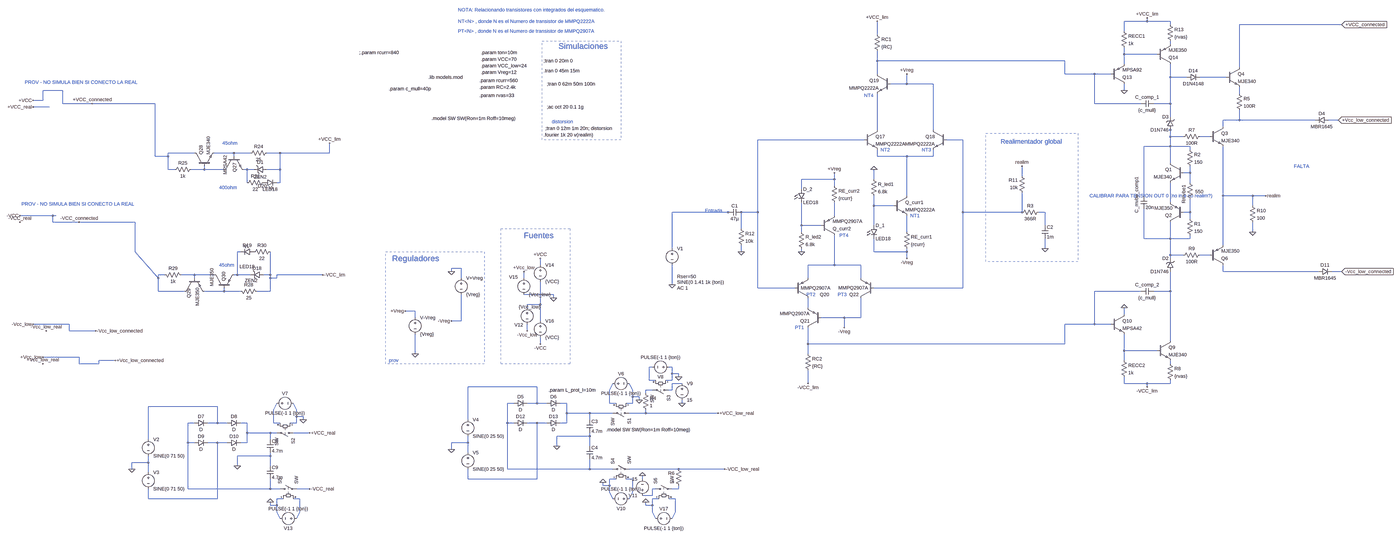
[diagram p0: schematic tercera-etapa-v4.asc, whole sheet]
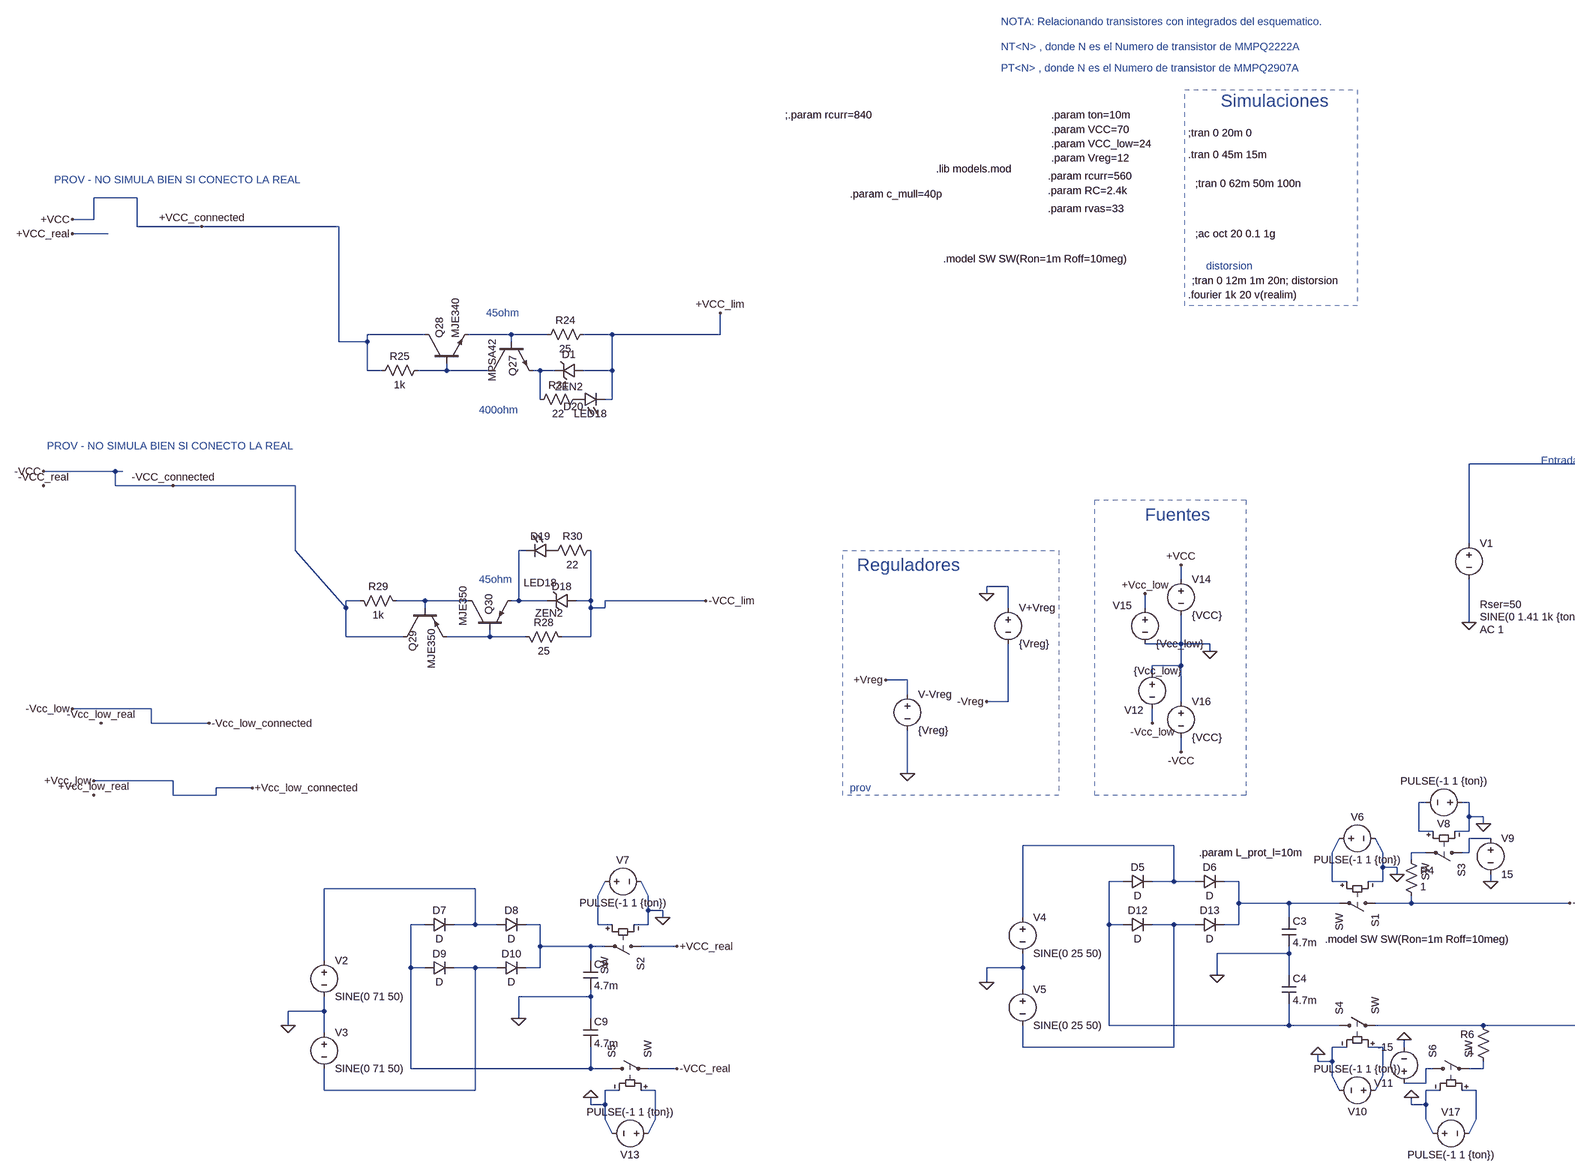
[diagram p1: schematic tercera-etapa-v4.asc, part, row 1 of 1, column 1 of 2]
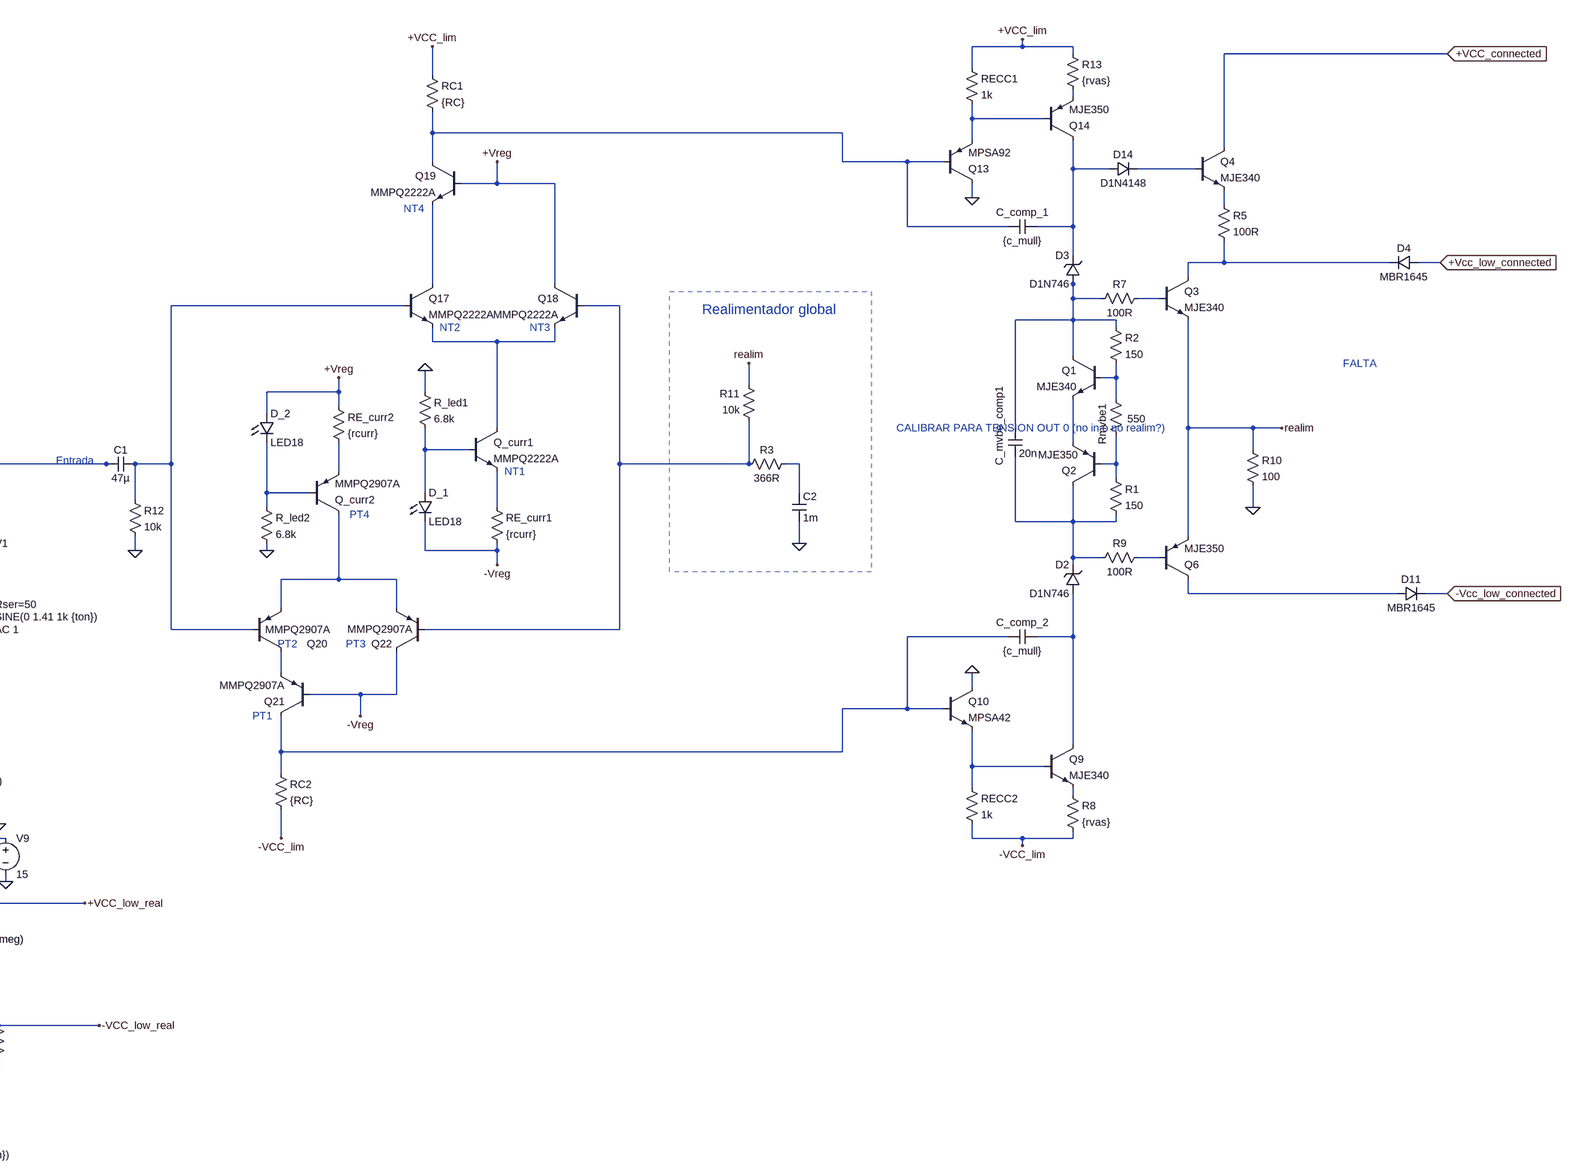
[diagram p2: schematic tercera-etapa-v4.asc, part, row 1 of 1, column 2 of 2]
tercera-etapa-v4.asc, the LTspice schematic file:
Version 4
SHEET 1 6132 2164
WIRE 1792 -752 1792 -768
WIRE 1792 -752 1680 -752
WIRE 1904 -752 1792 -752
WIRE 1904 -736 1904 -752
WIRE 2736 -736 2240 -736
WIRE 1680 -704 1680 -752
WIRE 464 -688 464 -752
WIRE 1904 -640 1904 -656
WIRE 1680 -592 1680 -624
WIRE 1840 -592 1680 -592
WIRE 464 -560 464 -608
WIRE 1392 -560 464 -560
WIRE 1680 -544 1680 -592
WIRE 2240 -528 2240 -736
WIRE 464 -496 464 -560
WIRE 1392 -496 1392 -560
WIRE 1536 -496 1392 -496
WIRE 1616 -496 1536 -496
WIRE 1904 -480 1904 -544
WIRE 1984 -480 1904 -480
WIRE 2176 -480 2048 -480
WIRE 608 -448 608 -496
WIRE 608 -448 528 -448
WIRE 736 -448 608 -448
WIRE -3504 -416 -3600 -416
WIRE 1680 -416 1680 -448
WIRE 2240 -400 2240 -432
WIRE -3600 -368 -3600 -416
WIRE -3600 -368 -3648 -368
WIRE -3504 -352 -3504 -416
WIRE -3360 -352 -3504 -352
WIRE -3056 -352 -3360 -352
WIRE 1536 -352 1536 -496
WIRE 1760 -352 1536 -352
WIRE 1904 -352 1904 -480
WIRE 1904 -352 1824 -352
WIRE -3568 -336 -3648 -336
WIRE 1904 -288 1904 -352
WIRE 2240 -272 2240 -320
WIRE 2240 -272 2160 -272
WIRE 2608 -272 2240 -272
WIRE 2720 -272 2672 -272
WIRE 2160 -240 2160 -272
WIRE 464 -224 464 -400
WIRE 736 -224 736 -448
WIRE 1904 -224 1904 -240
WIRE 1904 -192 1904 -224
WIRE 1968 -192 1904 -192
WIRE 2096 -192 2048 -192
WIRE 400 -176 -128 -176
WIRE 880 -176 800 -176
WIRE 1904 -144 1904 -192
WIRE 1904 -144 1776 -144
WIRE 2000 -144 1904 -144
WIRE 2000 -128 2000 -144
WIRE -2864 -112 -2992 -112
WIRE -2672 -112 -2768 -112
WIRE -2592 -112 -2672 -112
WIRE -2448 -112 -2512 -112
WIRE -2208 -112 -2208 -160
WIRE -2208 -112 -2448 -112
WIRE -3056 -96 -3056 -352
WIRE -2992 -96 -2992 -112
WIRE -2992 -96 -3056 -96
WIRE -2672 -96 -2672 -112
WIRE 464 -96 464 -128
WIRE 608 -96 464 -96
WIRE 736 -96 736 -128
WIRE 736 -96 608 -96
WIRE 1904 -64 1904 -144
WIRE -2992 -32 -2992 -96
WIRE -2960 -32 -2992 -32
WIRE -2816 -32 -2816 -48
WIRE -2816 -32 -2880 -32
WIRE -2720 -32 -2816 -32
WIRE -2608 -32 -2624 -32
WIRE -2576 -32 -2608 -32
WIRE -2448 -32 -2448 -112
WIRE -2448 -32 -2512 -32
WIRE 2000 -16 2000 -48
WIRE 2000 -16 1968 -16
WIRE 1184 0 1184 -48
WIRE 256 16 256 -16
WIRE 256 16 96 16
WIRE 448 16 448 -32
WIRE -2608 32 -2608 -32
WIRE -2448 32 -2448 -32
WIRE -2448 32 -2464 32
WIRE 2000 32 2000 -16
WIRE 256 48 256 16
WIRE 96 64 96 16
WIRE 608 96 608 -96
WIRE 1776 96 1776 -144
WIRE 2160 96 2160 -144
WIRE 2304 96 2160 96
WIRE 2368 96 2304 96
WIRE 1904 128 1904 32
WIRE 448 144 448 96
WIRE 544 144 448 144
WIRE 2304 144 2304 96
WIRE -272 176 -544 176
WIRE -256 176 -272 176
WIRE -128 176 -128 -176
WIRE -128 176 -208 176
WIRE 880 176 880 -176
WIRE 1184 176 1184 80
WIRE 1184 176 880 176
WIRE 1296 176 1264 176
WIRE 2000 176 2000 112
WIRE 2000 176 1968 176
WIRE -3552 192 -3712 192
WIRE -3536 192 -3552 192
WIRE 256 192 256 128
WIRE 2000 208 2000 176
WIRE -3552 224 -3552 192
WIRE -3424 224 -3552 224
WIRE -3152 224 -3424 224
WIRE 96 240 96 128
WIRE 192 240 96 240
WIRE 448 240 448 144
WIRE 1296 240 1296 176
WIRE -208 256 -208 176
WIRE 96 272 96 240
WIRE 608 272 608 192
WIRE 2304 272 2304 224
WIRE 1776 304 1776 160
WIRE 1904 304 1904 224
WIRE 1904 304 1776 304
WIRE 2000 304 2000 288
WIRE 2000 304 1904 304
WIRE 2160 336 2160 96
WIRE -544 352 -544 176
WIRE 1296 352 1296 304
WIRE -3152 368 -3152 224
WIRE -2640 368 -2656 368
WIRE -208 368 -208 336
WIRE 96 368 96 352
WIRE 448 368 448 304
WIRE 608 368 608 352
WIRE 608 368 448 368
WIRE 1904 384 1904 304
WIRE 1968 384 1904 384
WIRE 2096 384 2048 384
WIRE 608 400 608 368
WIRE 1904 400 1904 384
WIRE -1184 432 -1184 400
WIRE 256 432 256 288
WIRE 256 432 128 432
WIRE 384 432 256 432
WIRE -1568 448 -1616 448
WIRE -1616 464 -1616 448
WIRE 2160 464 2160 432
WIRE 2304 464 2160 464
WIRE 2624 464 2304 464
WIRE 2736 464 2688 464
WIRE -3008 480 -3040 480
WIRE -2864 480 -2928 480
WIRE -2768 480 -2864 480
WIRE -2656 480 -2656 368
WIRE -2656 480 -2672 480
WIRE -2592 480 -2656 480
WIRE -2496 480 -2496 368
WIRE -2496 480 -2528 480
WIRE -2240 480 -2464 480
WIRE -3040 496 -3152 368
WIRE -3040 496 -3040 480
WIRE -2864 496 -2864 480
WIRE -2496 496 -2496 480
WIRE -2464 496 -2464 480
WIRE -2464 496 -2496 496
WIRE -1568 496 -1568 448
WIRE -1264 496 -1264 464
WIRE 128 496 128 432
WIRE 384 496 384 432
WIRE -544 528 -544 432
WIRE -128 544 -128 176
WIRE 64 544 -128 544
WIRE 880 544 880 176
WIRE 880 544 448 544
WIRE -3040 560 -3040 496
WIRE -2912 560 -3040 560
WIRE -2720 560 -2720 544
WIRE -2720 560 -2816 560
WIRE -2640 560 -2720 560
WIRE -2496 560 -2496 496
WIRE -2496 560 -2560 560
WIRE 1760 560 1536 560
WIRE 1904 560 1904 464
WIRE 1904 560 1824 560
WIRE -1184 576 -1184 512
WIRE -1184 576 -1264 576
WIRE -1120 576 -1184 576
WIRE -1120 592 -1120 576
WIRE -1184 624 -1184 576
WIRE -1184 624 -1248 624
WIRE -1248 640 -1248 624
WIRE 128 640 128 592
WIRE -1792 656 -1840 656
WIRE 1680 672 1680 640
WIRE -1792 688 -1792 656
WIRE 304 688 192 688
WIRE 384 688 384 592
WIRE 384 688 304 688
WIRE -1568 704 -1568 576
WIRE -1568 704 -1616 704
WIRE -1184 704 -1184 624
WIRE -3472 720 -3648 720
WIRE 1536 720 1536 560
WIRE 1536 720 1392 720
WIRE 1616 720 1536 720
WIRE 304 736 304 688
WIRE -3472 752 -3472 720
WIRE -3344 752 -3472 752
WIRE -1248 752 -1248 720
WIRE 1904 800 1904 560
WIRE -1184 816 -1184 784
WIRE 128 816 128 736
WIRE 1392 816 1392 720
WIRE 1392 816 128 816
WIRE 1680 848 1680 768
WIRE 1840 848 1680 848
WIRE -1792 864 -1792 768
WIRE 128 864 128 816
WIRE -3424 880 -3600 880
WIRE -3248 896 -3328 896
WIRE 1680 896 1680 848
WIRE -3424 912 -3424 880
WIRE -3328 912 -3328 896
WIRE -3328 912 -3424 912
WIRE 1904 912 1904 896
WIRE -640 928 -656 928
WIRE -544 928 -560 928
WIRE -544 960 -544 928
WIRE -512 960 -544 960
WIRE -512 976 -512 960
WIRE -656 992 -656 928
WIRE -624 992 -656 992
WIRE -544 992 -544 960
WIRE -544 992 -576 992
WIRE -496 1008 -544 1008
WIRE 128 1008 128 944
WIRE 1680 1008 1680 976
WIRE 1792 1008 1680 1008
WIRE 1904 1008 1904 992
WIRE 1904 1008 1792 1008
WIRE -1200 1024 -1536 1024
WIRE 1792 1024 1792 1008
WIRE -848 1040 -832 1008
WIRE -736 1040 -752 1008
WIRE -640 1040 -672 1040
WIRE -544 1040 -544 1008
WIRE -544 1040 -560 1040
WIRE -672 1056 -672 1040
WIRE -736 1072 -736 1040
WIRE -704 1072 -736 1072
WIRE -704 1088 -704 1072
WIRE -1312 1104 -1344 1104
WIRE -1200 1104 -1200 1024
WIRE -1200 1104 -1248 1104
WIRE -1152 1104 -1200 1104
WIRE -1056 1104 -1088 1104
WIRE -848 1104 -848 1040
WIRE -816 1104 -848 1104
WIRE -736 1104 -736 1072
WIRE -736 1104 -768 1104
WIRE -496 1104 -496 1088
WIRE -2752 1120 -3088 1120
WIRE -2480 1136 -2464 1104
WIRE -2368 1136 -2384 1104
WIRE -1056 1152 -1056 1104
WIRE -944 1152 -1056 1152
WIRE -832 1152 -944 1152
WIRE -672 1152 -672 1136
WIRE -672 1152 -752 1152
WIRE -320 1152 -672 1152
WIRE -2368 1168 -2368 1136
WIRE -2336 1168 -2368 1168
WIRE -2336 1184 -2336 1168
WIRE -1536 1184 -1536 1024
WIRE -944 1184 -944 1152
WIRE -2864 1200 -2896 1200
WIRE -2752 1200 -2752 1120
WIRE -2752 1200 -2800 1200
WIRE -2704 1200 -2752 1200
WIRE -2608 1200 -2640 1200
WIRE -2480 1200 -2480 1136
WIRE -2448 1200 -2480 1200
WIRE -2368 1200 -2368 1168
WIRE -2368 1200 -2400 1200
WIRE -1344 1200 -1344 1104
WIRE -1312 1200 -1344 1200
WIRE -1200 1200 -1248 1200
WIRE -1152 1200 -1200 1200
WIRE -1056 1200 -1056 1152
WIRE -1056 1200 -1088 1200
WIRE -2608 1248 -2608 1200
WIRE -2496 1248 -2608 1248
WIRE -2464 1248 -2496 1248
WIRE -2304 1248 -2384 1248
WIRE -944 1264 -944 1248
WIRE -944 1264 -1104 1264
WIRE -3088 1280 -3088 1120
WIRE -2496 1280 -2496 1248
WIRE -2896 1296 -2896 1200
WIRE -2864 1296 -2896 1296
WIRE -2752 1296 -2800 1296
WIRE -2704 1296 -2752 1296
WIRE -2608 1296 -2608 1248
WIRE -2608 1296 -2640 1296
WIRE -1536 1296 -1536 1264
WIRE -1536 1296 -1616 1296
WIRE -1104 1312 -1104 1264
WIRE -944 1312 -944 1264
WIRE -1616 1328 -1616 1296
WIRE -1536 1344 -1536 1296
WIRE -2496 1360 -2496 1344
WIRE -2496 1360 -2656 1360
WIRE -3088 1392 -3088 1360
WIRE -3088 1392 -3168 1392
WIRE -2656 1408 -2656 1360
WIRE -2496 1408 -2496 1360
WIRE -3168 1424 -3168 1392
WIRE -1344 1424 -1344 1200
WIRE -944 1424 -944 1376
WIRE -944 1424 -1344 1424
WIRE -832 1424 -944 1424
WIRE -512 1424 -752 1424
WIRE -288 1424 -512 1424
WIRE -3088 1440 -3088 1392
WIRE -1536 1472 -1536 1424
WIRE -1200 1472 -1200 1200
WIRE -1200 1472 -1536 1472
WIRE -816 1472 -848 1472
WIRE -736 1472 -768 1472
WIRE -688 1472 -688 1456
WIRE -880 1504 -880 1488
WIRE -848 1504 -848 1472
WIRE -848 1504 -880 1504
WIRE -2896 1520 -2896 1296
WIRE -2496 1520 -2496 1472
WIRE -2496 1520 -2896 1520
WIRE -2448 1520 -2496 1520
WIRE -2304 1520 -2368 1520
WIRE -624 1520 -640 1520
WIRE -512 1520 -512 1504
WIRE -512 1520 -544 1520
WIRE -848 1536 -848 1504
WIRE -736 1536 -736 1472
WIRE -640 1552 -640 1520
WIRE -640 1552 -688 1552
WIRE -3088 1568 -3088 1520
WIRE -2752 1568 -2752 1296
WIRE -2752 1568 -3088 1568
WIRE -2432 1568 -2464 1568
WIRE -2352 1568 -2384 1568
WIRE -832 1568 -848 1536
WIRE -752 1568 -736 1536
WIRE -608 1568 -640 1568
WIRE -528 1568 -560 1568
WIRE -2496 1600 -2496 1584
WIRE -2464 1600 -2464 1568
WIRE -2464 1600 -2496 1600
WIRE -672 1600 -672 1584
WIRE -640 1600 -640 1568
WIRE -640 1600 -672 1600
WIRE -2464 1632 -2464 1600
WIRE -2352 1632 -2352 1568
WIRE -640 1632 -640 1600
WIRE -528 1632 -528 1568
WIRE -2448 1664 -2464 1632
WIRE -2368 1664 -2352 1632
WIRE -624 1664 -640 1632
WIRE -544 1664 -528 1632
FLAG -208 368 0
FLAG 1680 -416 0
FLAG 1680 640 0
FLAG -1840 656 +Vreg
FLAG -1616 704 -Vreg
FLAG 608 -496 +Vreg
FLAG 608 400 -Vreg
FLAG 256 -16 +Vreg
FLAG 304 736 -Vreg
FLAG 96 368 0
FLAG 448 -32 0
FLAG -1792 864 0
FLAG -1616 464 0
FLAG -3168 1424 0
FLAG -2656 1408 0
FLAG -2304 1248 +VCC_real
FLAG -2304 1520 -VCC_real
FLAG -2336 1184 0
FLAG -3360 -352 +VCC_connected
FLAG -3424 224 -VCC_connected
FLAG -3648 -368 +VCC
FLAG -3648 -336 +VCC_real
FLAG -3712 192 -VCC
FLAG -3712 224 -VCC_real
FLAG -2496 1584 0
FLAG 464 -752 +VCC_lim
FLAG 128 1008 -VCC_lim
FLAG 1792 -768 +VCC_lim
FLAG 1792 1024 -VCC_lim
FLAG -2208 -160 +VCC_lim
FLAG -2240 480 -VCC_lim
FLAG -544 528 0
FLAG 1296 352 0
FLAG 2736 464 -Vcc_low_connected
IOPIN 2736 464 In
FLAG 2720 -272 +Vcc_low_connected
IOPIN 2720 -272 In
FLAG -1616 1328 0
FLAG -1104 1312 0
FLAG -320 1152 +VCC_low_real
FLAG -704 1088 0
FLAG -512 976 0
FLAG -496 1104 0
FLAG -880 1488 0
FLAG -672 1584 0
FLAG -688 1456 0
FLAG -288 1424 -VCC_low_real
FLAG -3344 752 -Vcc_low_connected
FLAG -3648 720 -Vcc_low
FLAG -3584 752 -Vcc_low_real
FLAG -3600 880 +Vcc_low
FLAG -3600 912 +Vcc_low_real
FLAG -3248 896 +Vcc_low_connected
FLAG -1120 592 0
FLAG -1184 400 +VCC
FLAG -1264 464 +Vcc_low
FLAG -1248 752 -Vcc_low
FLAG -1184 816 -VCC
FLAG 2368 96 realim
FLAG 1184 -48 realim
FLAG 2736 -736 +VCC_connected
IOPIN 2736 -736 In
FLAG 2304 272 0
DATAFLAG 2304 464 "round($*100)/100"
SYMBOL npn 1840 800 R0
SYMATTR InstName Q9
SYMATTR Value MJE340
SYMBOL res 1888 896 R0
SYMATTR InstName R8
SYMATTR Value {rvas}
SYMBOL npn 1616 672 R0
SYMATTR InstName Q10
SYMATTR Value MPSA42
SYMBOL res 1200 96 R180
WINDOW 0 36 76 Left 2
WINDOW 3 36 40 Left 2
SYMATTR InstName R11
SYMATTR Value 10k
SYMBOL res -224 240 R0
SYMATTR InstName R12
SYMATTR Value 10k
SYMBOL pnp 1616 -448 M180
SYMATTR InstName Q13
SYMATTR Value MPSA92
SYMBOL pnp 1840 -544 M180
SYMATTR InstName Q14
SYMATTR Value MJE350
SYMBOL res 1888 -752 R0
SYMATTR InstName R13
SYMATTR Value {rvas}
SYMBOL voltage -1568 480 R0
WINDOW 123 0 0 Left 2
WINDOW 39 0 0 Left 2
SYMATTR InstName V+Vreg
SYMATTR Value {Vreg}
SYMBOL npn 544 96 R0
SYMATTR InstName Q_curr1
SYMATTR Value MMPQ2222A
SYMBOL npn 400 -224 R0
SYMATTR InstName Q17
SYMATTR Value MMPQ2222A
SYMBOL npn 800 -224 M0
SYMATTR InstName Q18
SYMATTR Value MMPQ2222A
SYMBOL res 432 0 R0
SYMATTR InstName R_led1
SYMATTR Value 6.8k
SYMBOL res 592 256 R0
SYMATTR InstName RE_curr1
SYMATTR Value {rcurr}
SYMBOL LED 432 240 R0
SYMATTR InstName D_1
SYMATTR Value LED18
SYMBOL res 448 -704 R0
SYMATTR InstName RC1
SYMATTR Value {RC}
SYMBOL npn 528 -496 M0
SYMATTR InstName Q19
SYMATTR Value MMPQ2222A
SYMBOL res 240 32 R0
SYMATTR InstName RE_curr2
SYMATTR Value {rcurr}
SYMBOL pnp 192 288 M180
SYMATTR InstName Q_curr2
SYMATTR Value MMPQ2907A
SYMBOL pnp 64 592 M180
WINDOW 0 121 16 Left 2
WINDOW 3 29 48 Left 2
SYMATTR InstName Q20
SYMATTR Value MMPQ2907A
SYMBOL pnp 192 736 R180
SYMATTR InstName Q21
SYMATTR Value MMPQ2907A
SYMBOL res 112 848 R0
SYMATTR InstName RC2
SYMATTR Value {RC}
SYMBOL pnp 448 592 R180
WINDOW 0 74 16 Left 2
WINDOW 3 28 49 Left 2
SYMATTR InstName Q22
SYMATTR Value MMPQ2907A
SYMBOL LED 80 64 R0
SYMATTR InstName D_2
SYMATTR Value LED18
SYMBOL res 80 256 R0
SYMATTR InstName R_led2
SYMATTR Value 6.8k
SYMBOL res 1664 880 R0
SYMATTR InstName RECC2
SYMATTR Value 1k
SYMBOL res 1664 -720 R0
SYMATTR InstName RECC1
SYMATTR Value 1k
SYMBOL voltage -1792 672 R0
WINDOW 123 0 0 Left 2
WINDOW 39 0 0 Left 2
SYMATTR InstName V-Vreg
SYMATTR Value {Vreg}
SYMBOL voltage -3088 1264 R0
WINDOW 123 0 0 Left 2
WINDOW 39 0 0 Left 2
SYMATTR InstName V2
SYMATTR Value SINE(0 71 50)
SYMBOL diode -2864 1216 R270
WINDOW 0 32 32 VTop 2
WINDOW 3 0 32 VBottom 2
SYMATTR InstName D7
SYMBOL diode -2704 1216 R270
WINDOW 0 32 32 VTop 2
WINDOW 3 0 32 VBottom 2
SYMATTR InstName D8
SYMBOL diode -2864 1312 R270
WINDOW 0 32 32 VTop 2
WINDOW 3 0 32 VBottom 2
SYMATTR InstName D9
SYMBOL diode -2704 1312 R270
WINDOW 0 32 32 VTop 2
WINDOW 3 0 32 VBottom 2
SYMATTR InstName D10
SYMBOL cap -2512 1280 R0
SYMATTR InstName C8
SYMATTR Value 4.7m
SYMBOL voltage -3088 1424 R0
WINDOW 123 0 0 Left 2
WINDOW 39 0 0 Left 2
SYMATTR InstName V3
SYMATTR Value SINE(0 71 50)
SYMBOL cap -2512 1408 R0
SYMATTR InstName C9
SYMATTR Value 4.7m
SYMBOL sw -2368 1248 R90
SYMATTR InstName S2
SYMBOL voltage -2480 1104 R270
WINDOW 0 32 56 VTop 2
WINDOW 3 -32 56 VBottom 2
WINDOW 123 0 0 Left 2
WINDOW 39 0 0 Left 2
SYMATTR InstName V7
SYMATTR Value PULSE(-1 1 {ton})
SYMBOL sw -2464 1520 R270
SYMATTR InstName S5
SYMBOL voltage -2352 1664 R90
WINDOW 0 32 56 VTop 2
WINDOW 3 -32 56 VBottom 2
WINDOW 123 0 0 Left 2
WINDOW 39 0 0 Left 2
SYMATTR InstName V13
SYMATTR Value PULSE(-1 1 {ton})
SYMBOL res -2496 -128 R90
WINDOW 0 0 56 VBottom 2
WINDOW 3 32 56 VTop 2
SYMATTR InstName R24
SYMATTR Value 25
SYMBOL res -2864 -48 R90
WINDOW 0 0 56 VBottom 2
WINDOW 3 32 56 VTop 2
SYMATTR InstName R25
SYMATTR Value 1k
SYMBOL npn -2720 -96 M90
WINDOW 0 32 52 Left 2
WINDOW 3 -6 6 Left 2
SYMATTR InstName Q27
SYMATTR Value MPSA42
SYMBOL npn -2864 -48 R270
SYMATTR InstName Q28
SYMATTR Value MJE340
SYMBOL res -2544 576 M270
WINDOW 0 32 56 VTop 2
WINDOW 3 0 56 VBottom 2
SYMATTR InstName R28
SYMATTR Value 25
SYMBOL res -2912 496 M270
WINDOW 0 32 56 VTop 2
WINDOW 3 0 56 VBottom 2
SYMATTR InstName R29
SYMATTR Value 1k
SYMBOL pnp -2912 496 M90
WINDOW 0 51 21 Left 2
WINDOW 3 46 63 Left 2
SYMATTR InstName Q29
SYMATTR Value MJE350
SYMBOL pnp -2768 544 R270
WINDOW 0 33 46 Left 2
WINDOW 3 8 -11 Left 2
SYMATTR InstName Q30
SYMATTR Value MJE350
SYMBOL zener -2528 464 R90
WINDOW 0 0 32 VBottom 2
WINDOW 3 28 60 VTop 2
SYMATTR InstName D18
SYMATTR Value ZEN2
SYMATTR Description Light Emitting Diode
SYMATTR Type led
SYMBOL LED -2576 352 R90
WINDOW 0 0 32 VBottom 2
WINDOW 3 72 32 VTop 2
SYMATTR InstName D19
SYMATTR Value LED18
SYMBOL res -2480 352 R90
WINDOW 0 0 56 VBottom 2
WINDOW 3 32 56 VTop 2
SYMATTR InstName R30
SYMATTR Value 22
SYMBOL LED -2528 48 R270
WINDOW 0 -16 -6 VTop 2
WINDOW 3 0 32 VBottom 2
SYMATTR InstName D20
SYMATTR Value LED18
SYMBOL res -2512 16 R90
WINDOW 0 0 56 VBottom 2
WINDOW 3 32 56 VTop 2
SYMATTR InstName R31
SYMATTR Value 22
SYMBOL rui\\shortcuts\\zener -2512 -48 R90
WINDOW 0 -4 32 VBottom 2
WINDOW 3 36 32 VTop 2
SYMATTR InstName D1
SYMATTR Value ZEN2
SYMBOL zener 1920 464 R180
WINDOW 0 24 64 Left 2
WINDOW 3 24 0 Left 2
SYMATTR InstName D2
SYMATTR Value D1N746
SYMBOL npn 1968 -64 M0
SYMATTR InstName Q1
SYMATTR Value MJE340
SYMBOL pnp 1968 224 R180
WINDOW 0 56 33 Left 2
WINDOW 3 53 68 Left 2
SYMATTR InstName Q2
SYMATTR Value MJE350
SYMBOL res 1984 16 R0
WINDOW 0 -14 116 VLeft 2
WINDOW 3 41 60 Left 2
SYMATTR InstName Rmvbe1
SYMATTR Value 550
SYMBOL res 1984 192 R0
SYMATTR InstName R1
SYMATTR Value 150
SYMBOL res 1984 -144 R0
SYMATTR InstName R2
SYMATTR Value 150
SYMBOL zener 1920 -224 R180
WINDOW 0 24 64 Left 2
WINDOW 3 24 0 Left 2
SYMATTR InstName D3
SYMATTR Value D1N746
SYMBOL cap -208 160 R90
WINDOW 0 0 32 VBottom 2
WINDOW 3 32 32 VTop 2
SYMATTR InstName C1
SYMATTR Value 47µ
SYMBOL voltage -544 336 R0
WINDOW 3 24 180 Left 2
WINDOW 123 24 208 Left 2
WINDOW 39 24 152 Left 2
SYMATTR Value SINE(0 1.41 1k {ton})
SYMATTR Value2 AC 1
SYMATTR SpiceLine Rser=50
SYMATTR InstName V1
SYMBOL res 1168 192 R270
WINDOW 0 32 56 VTop 2
WINDOW 3 0 56 VBottom 2
SYMATTR InstName R3
SYMATTR Value 366R
SYMBOL cap 1280 240 R0
SYMATTR InstName C2
SYMATTR Value 1m
SYMBOL npn 2096 -240 R0
SYMATTR InstName Q3
SYMATTR Value MJE340
SYMBOL pnp 2096 432 M180
SYMATTR InstName Q6
SYMATTR Value MJE350
SYMBOL res 2064 -208 R90
WINDOW 0 0 56 VBottom 2
WINDOW 3 32 56 VTop 2
SYMATTR InstName R7
SYMATTR Value 100R
SYMBOL res 2064 368 R90
WINDOW 0 0 56 VBottom 2
WINDOW 3 32 56 VTop 2
SYMATTR InstName R9
SYMATTR Value 100R
SYMBOL voltage -1536 1168 R0
WINDOW 123 0 0 Left 2
WINDOW 39 0 0 Left 2
SYMATTR InstName V4
SYMATTR Value SINE(0 25 50)
SYMBOL diode -1312 1120 R270
WINDOW 0 32 32 VTop 2
WINDOW 3 0 32 VBottom 2
SYMATTR InstName D5
SYMBOL diode -1152 1120 R270
WINDOW 0 32 32 VTop 2
WINDOW 3 0 32 VBottom 2
SYMATTR InstName D6
SYMBOL diode -1312 1216 R270
WINDOW 0 32 32 VTop 2
WINDOW 3 0 32 VBottom 2
SYMATTR InstName D12
SYMBOL diode -1152 1216 R270
WINDOW 0 32 32 VTop 2
WINDOW 3 0 32 VBottom 2
SYMATTR InstName D13
SYMBOL cap -960 1184 R0
SYMATTR InstName C3
SYMATTR Value 4.7m
SYMBOL voltage -1536 1328 R0
WINDOW 123 0 0 Left 2
WINDOW 39 0 0 Left 2
SYMATTR InstName V5
SYMATTR Value SINE(0 25 50)
SYMBOL cap -960 1312 R0
SYMATTR InstName C4
SYMATTR Value 4.7m
SYMBOL sw -736 1152 R90
SYMATTR InstName S1
SYMBOL voltage -848 1008 R270
WINDOW 0 32 56 VTop 2
WINDOW 3 -32 56 VBottom 2
WINDOW 123 0 0 Left 2
WINDOW 39 0 0 Left 2
SYMATTR InstName V6
SYMATTR Value PULSE(-1 1 {ton})
SYMBOL sw -544 1040 R90
SYMATTR InstName S3
SYMBOL voltage -544 928 R90
WINDOW 0 32 56 VTop 2
WINDOW 3 -32 56 VBottom 2
WINDOW 123 0 0 Left 2
WINDOW 39 0 0 Left 2
SYMATTR InstName V8
SYMATTR Value PULSE(-1 1 {ton})
SYMBOL voltage -496 992 R0
WINDOW 123 0 0 Left 2
WINDOW 39 0 0 Left 2
SYMATTR InstName V9
SYMATTR Value 15
SYMBOL res -688 1040 R0
SYMATTR InstName R4
SYMATTR Value 1
SYMBOL sw -848 1424 R270
SYMATTR InstName S4
SYMBOL voltage -736 1568 R90
WINDOW 0 32 56 VTop 2
WINDOW 3 -32 56 VBottom 2
WINDOW 123 0 0 Left 2
WINDOW 39 0 0 Left 2
SYMATTR InstName V10
SYMATTR Value PULSE(-1 1 {ton})
SYMBOL sw -640 1520 R270
SYMATTR InstName S6
SYMBOL voltage -688 1568 R180
WINDOW 123 0 0 Left 2
WINDOW 39 0 0 Left 2
SYMATTR InstName V11
SYMATTR Value -15
SYMBOL res -496 1520 R180
WINDOW 0 36 76 Left 2
WINDOW 3 36 40 Left 2
SYMATTR InstName R6
SYMATTR Value 1
SYMBOL voltage -1248 624 R0
WINDOW 0 -62 99 Left 2
WINDOW 3 -41 12 Left 2
WINDOW 123 0 0 Left 2
WINDOW 39 0 0 Left 2
SYMATTR InstName V12
SYMATTR Value {Vcc_low}
SYMBOL voltage -1184 416 R0
WINDOW 123 0 0 Left 2
WINDOW 39 0 0 Left 2
SYMATTR InstName V14
SYMATTR Value {VCC}
SYMBOL voltage -1264 480 R0
WINDOW 0 -72 11 Left 2
WINDOW 123 0 0 Left 2
WINDOW 39 0 0 Left 2
SYMATTR InstName V15
SYMATTR Value {Vcc_low}
SYMBOL voltage -1184 688 R0
WINDOW 123 0 0 Left 2
WINDOW 39 0 0 Left 2
SYMATTR InstName V16
SYMATTR Value {VCC}
SYMBOL voltage -640 1664 R270
WINDOW 0 32 56 VTop 2
WINDOW 3 -32 56 VBottom 2
WINDOW 123 0 0 Left 2
WINDOW 39 0 0 Left 2
SYMATTR InstName V17
SYMATTR Value PULSE(-1 1 {ton})
SYMBOL cap 1824 -368 R90
WINDOW 0 0 32 VBottom 2
WINDOW 3 32 32 VTop 2
SYMATTR InstName C_comp_1
SYMATTR Value {c_mull}
SYMBOL cap 1824 544 R90
WINDOW 0 0 32 VBottom 2
WINDOW 3 32 32 VTop 2
SYMATTR InstName C_comp_2
SYMATTR Value {c_mull}
SYMBOL cap 1760 96 R0
WINDOW 0 -19 83 VLeft 2
SYMATTR InstName C_mvbe_comp1
SYMATTR Value 20n
SYMBOL diode 2672 -256 M270
WINDOW 0 32 32 VTop 2
WINDOW 3 0 32 VBottom 2
SYMATTR InstName D4
SYMATTR Value MBR1645
SYMBOL diode 2624 480 R270
WINDOW 0 32 32 VTop 2
WINDOW 3 0 32 VBottom 2
SYMATTR InstName D11
SYMATTR Value MBR1645
SYMBOL npn 2176 -528 R0
SYMATTR InstName Q4
SYMATTR Value MJE340
SYMBOL res 2224 -416 R0
SYMATTR InstName R5
SYMATTR Value 100R
SYMBOL diode 1984 -464 R270
WINDOW 0 32 32 VTop 2
WINDOW 3 0 32 VBottom 2
SYMATTR InstName D14
SYMATTR Value D1N4148
SYMBOL res 2288 128 R0
SYMATTR InstName R10
SYMATTR Value 100
TEXT -1168 -560 Left 2 !;tran 0 20m 0
TEXT -1168 -200 Left 2 !.fourier 1k 20 v(realim)
TEXT -1264 288 Left 4 ;Fuentes
TEXT -1096 -632 Left 4 ;Simulaciones
TEXT -1160 -232 Left 2 !;tran 0 12m 1m 20n; distorsion
TEXT -1128 -264 Left 2 ;distorsion
TEXT -1152 -336 Left 2 !;ac oct 20 0.1 1g
TEXT -1728 -480 Left 2 !.lib models.mod
TEXT -1904 400 Left 4 ;Reguladores
TEXT -1920 896 Left 2 ;prov
TEXT 1080 -168 Left 3 ;Realimentador global
TEXT 480 -128 Left 2 ;NT2
TEXT 680 -128 Left 2 ;NT3
TEXT 624 192 Left 2 ;NT1
TEXT 400 -392 Left 2 ;NT4
TEXT 120 576 Left 2 ;PT2
TEXT -1584 -752 Left 2 ;NT<N> , donde N es el Numero de transistor de MMPQ2222A
TEXT -1584 -704 Left 2 ;PT<N> , donde N es el Numero de transistor de MMPQ2907A
TEXT -1584 -808 Left 2 ;NOTA: Relacionando transistores con integrados del esquematico.
TEXT 64 736 Left 2 ;PT1
TEXT 272 576 Left 2 ;PT3
TEXT 280 288 Left 2 ;PT4
TEXT -1472 -568 Left 2 !.param VCC=70
TEXT -1472 -504 Left 2 !.param Vreg=12
TEXT -1480 -432 Left 2 !.param RC=2.4k
TEXT -1480 -392 Left 2 !.param rvas=33
TEXT -1480 -464 Left 2 !.param rcurr=560
TEXT -1168 -512 Left 2 !.tran 0 45m 15m
TEXT -1472 -600 Left 2 !.param ton=10m
TEXT -1152 -448 Left 2 !;tran 0 62m 50m 100n
TEXT -2064 -600 Left 2 !;.param rcurr=840
TEXT -2744 56 Left 2 ;400ohm
TEXT -2728 -160 Left 2 ;45ohm
TEXT -2744 432 Left 2 ;45ohm
TEXT -1712 -280 Left 2 !.model SW SW(Ron=1m Roff=10meg)
TEXT -3688 -456 Left 2 ;PROV - NO SIMULA BIEN SI CONECTO LA REAL
TEXT -3704 136 Left 2 ;PROV - NO SIMULA BIEN SI CONECTO LA REAL
TEXT -384 168 Left 2 ;Entrada
TEXT -1144 1040 Left 2 !.param L_prot_l=10m
TEXT -864 1232 Left 2 !.model SW SW(Ron=1m Roff=10meg)
TEXT -1472 -536 Left 2 !.param VCC_low=24
TEXT 1512 96 Left 2 ;CALIBRAR PARA TENSION OUT 0 (no in o no realim?)
TEXT -1920 -424 Left 2 !.param c_mull=40p
TEXT 2504 -48 Left 2 ;FALTA
RECTANGLE Normal -1040 912 -1376 256 2
RECTANGLE Normal -792 -176 -1176 -656 2
RECTANGLE Normal -1456 912 -1936 368 2
RECTANGLE Normal 1456 416 1008 -208 2

The netlist it stands for:
* tercera-etapa-v4.asc
Q9 N034 N036 N037 0 MJE340
R8 N037 -VCC_lim {rvas}
Q10 0 N033 N036 0 MPSA42
R11 N012 realim 10k
R12 N011 0 10k
Q13 0 N003 N002 0 MPSA92
Q14 N004 N002 N001 0 MJE350
R13 +VCC_lim N001 {rvas}
V+Vreg 0 -Vreg {Vreg}
Q_curr1 N014 N019 N025 0 MMPQ2222A
Q17 N008 N011 N014 0 MMPQ2222A
Q18 +Vreg N012 N014 0 MMPQ2222A
R_led1 0 N019 6.8k
RE_curr1 N025 -Vreg {rcurr}
D_1 N019 -Vreg LED18
RC1 +VCC_lim N003 {RC}
Q19 N003 +Vreg N008 0 MMPQ2222A
RE_curr2 +Vreg N023 {rcurr}
Q_curr2 N029 N024 N023 0 MMPQ2907A
Q20 N035 N011 N029 0 MMPQ2907A
Q21 N033 -Vreg N035 0 MMPQ2907A
RC2 N033 -VCC_lim {RC}
Q22 -Vreg N012 N029 0 MMPQ2907A
D_2 +Vreg N024 LED18
R_led2 N024 0 6.8k
RECC2 N036 -VCC_lim 1k
RECC1 +VCC_lim N002 1k
V-Vreg +Vreg 0 {Vreg}
V2 N045 0 SINE(0 71 50)
D7 N047 N045 D
D8 N045 N048 D
D9 N047 N050 D
D10 N050 N048 D
C8 N048 0 4.7m
V3 0 N050 SINE(0 71 50)
C9 0 N047 4.7m
S2 +VCC_real N048 N046 0 SW
V7 N046 0 PULSE(-1 1 {ton})
S5 N047 -VCC_real N054 0 SW
V13 N054 0 PULSE(-1 1 {ton})
R24 +VCC_lim N013 25
R25 N015 +VCC 1k
Q27 N015 N013 N016 0 MPSA42
Q28 +VCC N015 N013 0 MJE340
R28 -VCC_lim N032 25
R29 N031 -VCC 1k
Q29 -VCC N031 N032 0 MJE350
Q30 N031 N032 N027 0 MJE350
D18 -VCC_lim N027 ZEN2
D19 P001 N027 LED18
R30 -VCC_lim P001 22
D20 P002 +VCC_lim LED18
R31 P002 N016 22
D1 +VCC_lim N016 ZEN2
D2 N034 N026 D1N746
Q1 N009 N017 N018 0 MJE340
Q2 N026 N022 N018 0 MJE350
Rmvbe1 N017 N022 550
R1 N022 N026 150
R2 N009 N017 150
D3 N009 N004 D1N746
C1 N011 N020 47µ
V1 N020 0 SINE(0 1.41 1k {ton}) AC 1 Rser=50
R3 N012 N021 366R
C2 N021 0 1m
Q3 N007 N010 realim 0 MJE340
Q6 N030 N028 realim 0 MJE350
R7 N010 N009 100R
R9 N028 N026 100R
V4 N040 0 SINE(0 25 50)
D5 N043 N040 D
D6 N040 N044 D
D12 N043 N049 D
D13 N049 N044 D
C3 N044 0 4.7m
V5 0 N049 SINE(0 25 50)
C4 0 N043 4.7m
S1 +VCC_low_real N044 N041 0 SW
V6 N041 0 PULSE(-1 1 {ton})
S3 N039 N042 N038 0 SW
V8 0 N038 PULSE(-1 1 {ton})
V9 N039 0 15
R4 N042 +VCC_low_real 1
S4 N043 -VCC_low_real N051 0 SW
V10 N051 0 PULSE(-1 1 {ton})
S6 N052 N053 N055 0 SW
V11 N052 0 -15
R6 N053 -VCC_low_real 1
V12 0 -Vcc_low {Vcc_low}
V14 +VCC 0 {VCC}
V15 +Vcc_low 0 {Vcc_low}
V16 0 -VCC {VCC}
V17 0 N055 PULSE(-1 1 {ton})
C_comp_1 N004 N003 {c_mull}
C_comp_2 N034 N033 {c_mull}
C_mvbe_comp1 N009 N026 20n
D4 +Vcc_low N007 MBR1645
D11 N030 -Vcc_low MBR1645
Q4 +VCC N005 N006 0 MJE340
R5 N006 N007 100R
D14 N004 N005 D1N4148
R10 realim 0 100
.model D D
.lib standard.dio
.model NPN NPN
.model PNP PNP
.lib standard.bjt
;tran 0 20m 0
.fourier 1k 20 v(realim)
* Fuentes
* Simulaciones
;tran 0 12m 1m 20n; distorsion
* distorsion
;ac oct 20 0.1 1g
.lib models.mod
* Reguladores
* prov
* Realimentador global
* NT2
* NT3
* NT1
* NT4
* PT2
* NT<N> , donde N es el Numero de transistor de MMPQ2222A
* PT<N> , donde N es el Numero de transistor de MMPQ2907A
* NOTA: Relacionando transistores con integrados del esquematico.
* PT1
* PT3
* PT4
.param VCC=70
.param Vreg=12
.param RC=2.4k
.param rvas=33
.param rcurr=560
.tran 0 45m 15m
.param ton=10m
;tran 0 62m 50m 100n
;.param rcurr=840
* 400ohm
* 45ohm
* 45ohm
.model SW SW(Ron=1m Roff=10meg)
* PROV - NO SIMULA BIEN SI CONECTO LA REAL
* PROV - NO SIMULA BIEN SI CONECTO LA REAL
* Entrada
.param L_prot_l=10m
.model SW SW(Ron=1m Roff=10meg)
.param VCC_low=24
* CALIBRAR PARA TENSION OUT 0 (no in o no realim?)
.param c_mull=40p
* FALTA
.backanno
.end